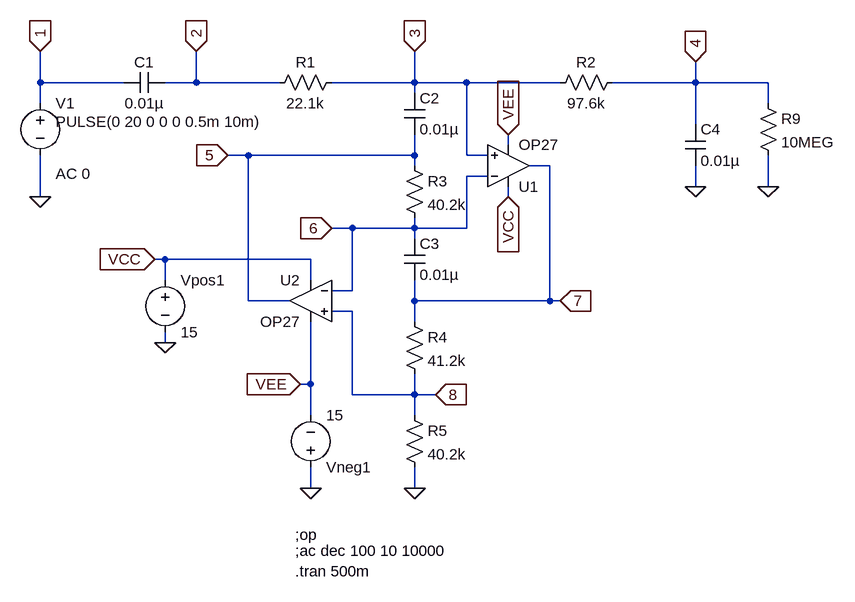
[diagram p0: schematic OpAmp circuit 2.asc]
OpAmp circuit 2.asc, the LTspice schematic file:
Version 4
SHEET 1 1416 864
WIRE -352 96 -352 48
WIRE -224 96 -352 96
WIRE -112 96 -112 48
WIRE -112 96 -160 96
WIRE 16 96 -112 96
WIRE 224 96 224 48
WIRE 224 96 96 96
WIRE 304 96 224 96
WIRE 448 96 304 96
WIRE 656 96 656 64
WIRE 656 96 528 96
WIRE 768 96 656 96
WIRE 224 112 224 96
WIRE -352 128 -352 96
WIRE 768 128 768 96
WIRE 656 160 656 96
WIRE 368 192 368 176
WIRE -32 208 -64 208
WIRE 224 208 224 176
WIRE 224 208 -32 208
WIRE 304 208 304 96
WIRE 336 208 304 208
WIRE 224 224 224 208
WIRE 432 224 400 224
WIRE 336 240 304 240
WIRE 656 256 656 224
WIRE 768 256 768 208
WIRE -352 272 -352 208
WIRE 368 272 368 256
WIRE 128 320 96 320
WIRE 224 320 224 304
WIRE 224 320 128 320
WIRE 304 320 304 240
WIRE 304 320 224 320
WIRE 224 336 224 320
WIRE -160 368 -176 368
WIRE 64 368 -160 368
WIRE -160 400 -160 368
WIRE 64 400 64 368
WIRE 128 416 128 320
WIRE 128 416 96 416
WIRE -32 432 -32 208
WIRE 32 432 -32 432
WIRE 224 432 224 400
WIRE 432 432 432 224
WIRE 432 432 224 432
WIRE 448 432 432 432
WIRE 128 448 96 448
WIRE 224 464 224 432
WIRE -160 496 -160 480
WIRE 64 560 64 464
WIRE 64 560 48 560
WIRE 128 576 128 448
WIRE 224 576 224 544
WIRE 224 576 128 576
WIRE 256 576 224 576
WIRE 64 608 64 560
WIRE 224 608 224 576
WIRE 64 720 64 688
WIRE 224 720 224 688
FLAG -352 272 0
FLAG 224 720 0
FLAG 656 256 0
FLAG 64 720 0
FLAG -160 496 0
FLAG -352 48 1
IOPIN -352 48 In
FLAG -112 48 2
IOPIN -112 48 In
FLAG 224 48 3
IOPIN 224 48 In
FLAG 656 64 4
IOPIN 656 64 In
FLAG -64 208 5
IOPIN -64 208 In
FLAG 96 320 6
IOPIN 96 320 In
FLAG 448 432 7
IOPIN 448 432 In
FLAG 256 576 8
IOPIN 256 576 In
FLAG 768 256 0
FLAG -176 368 VCC
IOPIN -176 368 In
FLAG 368 272 VCC
IOPIN 368 272 In
FLAG 368 176 VEE
IOPIN 368 176 In
FLAG 48 560 VEE
IOPIN 48 560 In
SYMBOL voltage -352 112 R0
WINDOW 123 24 124 Left 2
WINDOW 39 0 0 Left 2
WINDOW 3 24 44 Left 2
SYMATTR Value2 AC 0
SYMATTR InstName V1
SYMATTR Value PULSE(0 20 0 0 0 0.5m 10m)
SYMBOL cap -224 112 R270
WINDOW 0 32 32 VTop 2
WINDOW 3 0 32 VBottom 2
SYMATTR InstName C1
SYMATTR Value 0.01µ
SYMBOL cap 208 112 R0
SYMATTR InstName C2
SYMATTR Value 0.01µ
SYMBOL cap 208 336 R0
SYMATTR InstName C3
SYMATTR Value 0.01µ
SYMBOL cap 640 160 R0
SYMATTR InstName C4
SYMATTR Value 0.01µ
SYMBOL res 0 112 R270
WINDOW 0 32 56 VTop 2
WINDOW 3 0 56 VBottom 2
SYMATTR InstName R1
SYMATTR Value 22.1k
SYMBOL res 432 112 R270
WINDOW 0 32 56 VTop 2
WINDOW 3 0 56 VBottom 2
SYMATTR InstName R2
SYMATTR Value 97.6k
SYMBOL res 208 208 R0
SYMATTR InstName R3
SYMATTR Value 40.2k
SYMBOL res 208 448 R0
SYMATTR InstName R4
SYMATTR Value 41.2k
SYMBOL res 208 592 R0
SYMATTR InstName R5
SYMATTR Value 40.2k
SYMBOL Opamps\\OP27 368 288 M180
SYMATTR InstName U1
SYMBOL Opamps\\OP27 64 368 M0
SYMATTR InstName U2
SYMBOL voltage 64 704 M180
WINDOW 123 0 0 Left 2
WINDOW 39 0 0 Left 2
SYMATTR InstName Vneg1
SYMATTR Value 15
SYMBOL voltage -160 384 R0
WINDOW 123 0 0 Left 2
WINDOW 39 0 0 Left 2
SYMATTR InstName Vpos1
SYMATTR Value 15
SYMBOL res 752 112 R0
SYMATTR InstName R9
SYMATTR Value 10MEG
TEXT 40 792 Left 2 !;op
TEXT 40 816 Left 2 !;ac dec 100 10 10000
TEXT 40 848 Left 2 !.tran 500m

The netlist it stands for:
* OpAmp circuit 2.asc
V1 1 0 PULSE(0 20 0 0 0 0.5m 10m) AC 0
C1 1 2 0.01µ
C2 3 5 0.01µ
C3 6 7 0.01µ
C4 4 0 0.01µ
R1 2 3 22.1k
R2 3 4 97.6k
R3 5 6 40.2k
R4 7 8 41.2k
R5 8 0 40.2k
XU1 3 6 VCC VEE 7 OP27  ; pins In+ In- V+ V- OUT
XU2 8 6 VCC VEE 5 OP27  ; pins In+ In- V+ V- OUT
Vneg1 0 VEE 15
Vpos1 VCC 0 15
R9 4 0 10MEG
;op
;ac dec 100 10 10000
.tran 500m
.lib ADI.lib
.backanno
.end